# EAGLE design VGAX board rev 17 for JCL (EAGLE 9.6.2)
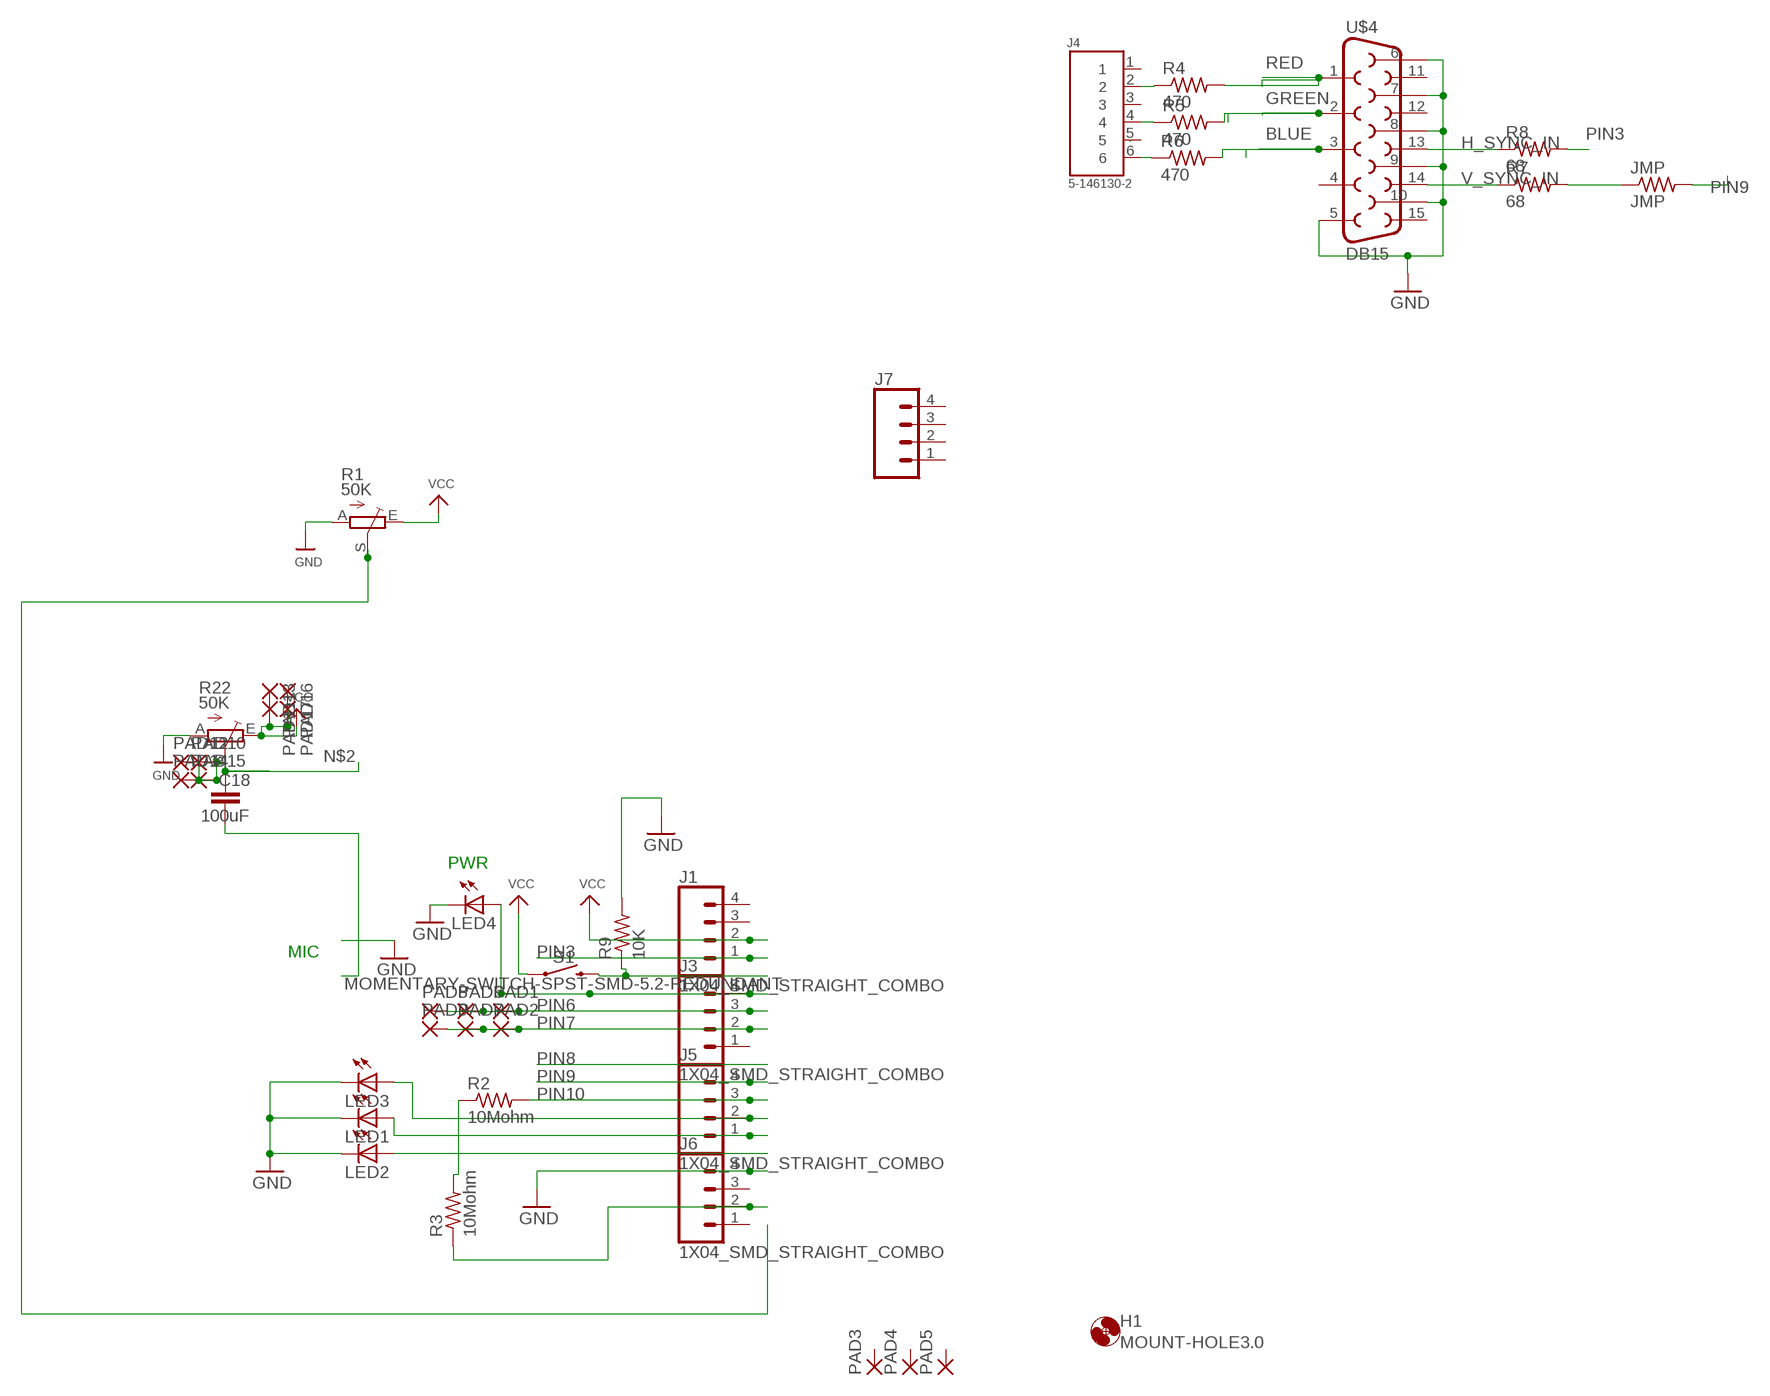
[diagram p0: schematic, sheet 1]

## Parts
C18  100uF  1.0UF-1206-50V-10%  [1206]
H1  MOUNT-HOLE3.0  [3,0]
J1  1X04_SMD_STRAIGHT_COMBO  CONN_04SMD_STRAIGHT_COMBO  [1X04_SMD_VERTICAL_COMBO]
J3  1X04_SMD_STRAIGHT_COMBO  CONN_04SMD_STRAIGHT_COMBO  [1X04_SMD_VERTICAL_COMBO]
J4  5-146130-2  [5-146130-2]
J5  1X04_SMD_STRAIGHT_COMBO  CONN_04SMD_STRAIGHT_COMBO  [1X04_SMD_VERTICAL_COMBO]
J6  1X04_SMD_STRAIGHT_COMBO  CONN_04SMD_STRAIGHT_COMBO  [1X04_SMD_VERTICAL_COMBO]
J7  1X04_SMD_STRAIGHT_COMBO  CONN_04SMD_STRAIGHT_COMBO  [1X04_SMD_VERTICAL_COMBO]
JMP  JMP  R-US_M1206  [M1206]
LED1  LEDCHIPLED_1206  [CHIPLED_1206]
LED2  LEDCHIPLED_1206  [CHIPLED_1206]
LED3  LEDCHIPLED_1206  [CHIPLED_1206]
LED4  LEDCHIPLED_1206  [CHIPLED_1206]
PAD1  SMD2  [SMD1,27-2,54]
PAD2  SMD2  [SMD1,27-2,54]
PAD3  SMD2  [SMD1,27-2,54]
PAD4  SMD2  [SMD1,27-2,54]
PAD5  SMD2  [SMD1,27-2,54]
PAD6  SMD2  [SMD1,27-2,54]
PAD7  SMD2  [SMD1,27-2,54]
PAD8  SMD2  [SMD1,27-2,54]
PAD9  SMD2  [SMD1,27-2,54]
PAD10  SMD2  [SMD1,27-2,54]
PAD11  SMD2  [SMD1,27-2,54]
PAD12  SMD2  [SMD1,27-2,54]
PAD13  SMD2  [SMD1,27-2,54]
PAD14  SMD2  [SMD1,27-2,54]
PAD15  SMD2  [SMD1,27-2,54]
PAD16  SMD2  [SMD1,27-2,54]
PAD17  SMD2  [SMD1,27-2,54]
R1  50K  TRIM_EU-CA9V  [CA9V]
R2  10Mohm  R-US_M1206  [M1206]
R3  10Mohm  R-US_M1206  [M1206]
R4  470  R-US_M1206  [M1206]
R5  470  R-US_M1206  [M1206]
R6  470  R-US_M1206  [M1206]
R7  68  R-US_M1206  [M1206]
R8  68  R-US_M1206  [M1206]
R9  10K  R-US_M1206  [M1206]
R22  50K  TRIM_EU-CA9V  [CA9V]
S1  MOMENTARY-SWITCH-SPST-SMD-5.2-REDUNDANT  [TACTILE_SWITCH_SMD_5.2MM]
U$4  DB15  [DB15]

## Nets
BLUE: R6.2 U$4.3
GND: J6.4 LED1.C LED2.C LED3.C LED4.C R1.A R9.2 R22.A U$4.5 U$4.6 U$4.7 U$4.8 U$4.9 U$4.10
GREEN: R5.2 U$4.2
H_SYNC_IN: R8.1 U$4.13
N$1: JMP.1 R7.2
N$2: C18.1 PAD10.1(P) PAD12.1(P) PAD14.1(P) PAD15.1(P) R22.S
N$4: R1.S
N$5: R2.1 R3.2
N$6: LED2.A
N$7: J5.1 LED1.A
N$8: J5.2 LED3.A
N$11: C18.2
N$12: J3.4 LED4.A
N$13: R9.1 S1.3 S1.4
N$15: J4.6 R6.1
N$16: J4.4 R5.1
N$17: J4.2 R4.1
PIN3: J1.1 R8.2
PIN6: J3.3 PAD1.1(P) PAD6.1(P) PAD8.1(P)
PIN7: J3.2 PAD2.1(P) PAD7.1(P) PAD9.1(P)
PIN8: J6.2 R3.1
PIN9: J5.4 JMP.2
PIN10: J5.3 R2.2
RED: R4.2 U$4.1
V_SYNC_IN: R7.1 U$4.14
VCC: J1.2 PAD11.1(P) PAD16.1(P) PAD17.1(P) R1.E R22.E S1.1 S1.2
Unconnected: J1.3 J1.4 J3.1 J4.1 J4.3 J4.5 J6.1 J6.3 J7.1 J7.2 J7.3 J7.4 PAD3.1(P) PAD4.1(P) PAD5.1(P) PAD13.1(P) U$4.4 U$4.11 U$4.12 U$4.15

## Notes on the sheet
- PWR
- MIC

## Library data of the parts
C18 = SparkFun-Capacitors:1.0UF: 1µF ceramic capacitors A capacitor is a passive two-terminal electrical component used to store electrical energy temporarily in an electric field.; PROD_ID: CAP-09822; VALUE: 1.0uF
H1 = holes:MOUNT-HOLE: MOUNTING HOLE with drill center marker
J1 J3 J5-J7 = SparkFun-Connectors:CONN_04: Multi connection point. Often used as Generic Header-pin footprint for 0.1 inch spaced/style header connections On any of the 0.1 inch spaced packages, you can populate with these: Break Away Headers - Straight <https://www.sparkfun.com/products/116> (PRT-00116) Break Away Male Headers - Right Angle <https://www.sparkfun.com/products/553> (PRT-00553) Female Headers <https://www.sparkfun.com/products/115> (PRT-00115) Break Away Headers - Machine Pin <https://www.sparkfun.com/products/117> (PRT-00117) Break Away Female Headers - Swiss Machine Pin <https://www.sparkfun.com/products/743> (PRT-00743) For SCREWTERMINALS and SPRING TERMINALS visit here: Screw Terimnals on SparkFun.com <https://www.sparkfun.com/search/results?term=Screw+Terminals> (5mm/3.5mm/2.54mm spacing) This device is also useful as a general connection point to wire up your design to another part of your project. Our various solder wires solder well into these plated through hole pads. Hook-Up Wire - Assortment (Stranded, 22 AWG) <https://www.sparkfun.com/products/11375> (PRT-11375) Hook-Up Wire - Assortment (Solid Core, 22 AWG) <https://www.sparkfun.com/products/11367> (PRT-11367) View the entire wire category on our website here <https://www.sparkfun.com/categories/141> Special notes: Molex polarized connector foot print use with SKU : PRT-08231 with associated crimp pins and housings. 1MM SMD Version SKU: PRT-10208; PROD_ID: CONN-08511
J4 = Connectors:5-146130-2: CONN HEADER SMD 6POS 2.54MM Manufacturer's datasheet <https://www.te.com/commerce/DocumentDelivery/DDEController?Action=srchrtrv&DocNm=146130&DocType=Customer+Drawing&DocLang=English>; CREATED_BY: PCBLayout.com; DIGIKEY_PART_NUMBER: 5-146130-2-ND; MANUFACTURER: TE Connectivity AMP Connectors; MPN: 5-146130-2
JMP R2-R9 = adafruit:R-US_: RESISTOR, American symbol
LED1-LED4 = adafruit:LED: LED OSRAM: - CHIPLED LG R971, LG N971, LY N971, LG Q971, LY Q971, LO R971, LY R971 LH N974, LH R974 LS Q976, LO Q976, LY Q976 LO Q996 - Hyper CHIPLED LW Q18S LB Q993, LB Q99A, LB R99A - SideLED LS A670, LO A670, LY A670, LG A670, LP A670 LB A673, LV A673, LT A673, LW A673 LH A674 LY A675 LS A676, LA A676, LO A676, LY A676, LW A676 LS A679, LY A679, LG A679 - Hyper Micro SIDELED® LS Y876, LA Y876, LO Y876, LY Y876 LT Y87S - SmartLED LW L88C, LW L88S LB L89C, LB L89S, LG L890 LS L89K, LO L89K, LY L89K LS L896, LA L896, LO L896, LY L896 - TOPLED LS T670, LO T670, LY T670, LG T670, LP T670 LSG T670, LSP T670, LSY T670, LOP T670, LYG T670 LG T671, LOG T671, LSG T671 LB T673, LV T673, LT T673, LW T673 LH T674 LS T676, LA T676, LO T676, LY T676, LB T676, LH T676, LSB T676, LW T676 LB T67C, LV T67C, LT T67C, LS T67K, LO T67K, LY T67K, LW E67C LS E67B, LA E67B, LO E67B, LY E67B, LB E67C, LV E67C, LT E67C LW T67C LS T679, LY T679, LG T679 LS T770, LO T770, LY T770, LG T770, LP T770 LB T773, LV T773, LT T773, LW T773 LH T774 LS E675, LA E675, LY E675, LS T675 LS T776, LA T776, LO T776, LY T776, LB T776 LHGB T686 LT T68C, LB T68C - Hyper Mini TOPLED® LB M676 - Mini TOPLED Santana® LG M470 LS M47K, LO M47K, LY M47K Source: http://www.osram.convergy.de/
PAD1-PAD17 = wirepad:SMD2: SMD PAD
R1 R22 = pot:TRIM_EU-: POTENTIOMETER
S1 = SparkFun-Switches:MOMENTARY-SWITCH-SPST: Momentary Switch (Pushbutton) - SPST Normally-open (NO) SPST momentary switches (buttons, pushbuttons). Variants PTH-12MM - 12mm square, through-hole Momentary Pushbutton Switch - 12mm Square <https://www.sparkfun.com/products/9190> (COM-09190) PTH-6.0MM, PTH-6.0MM-KIT - 6.0mm square, through-hole Mini Pushbutton Switch <https://www.sparkfun.com/products/97> (COM-00097) KIT package intended for soldering kit's - only one side of pads' copper is exposed. PTH-RIGHT-ANGLE-KIT - Right-angle, through-hole Right Angle Tactile Button <https://www.sparkfun.com/products/10791> - Used on SparkFun BigTime Watch Kit <https://www.sparkfun.com/products/11734> SMD-12MM - 12mm square, surface-mount Tactile Button - SMD (12mm) <https://www.sparkfun.com/products/12993> (COM-12993) Used on SparkFun PicoBoard <https://www.sparkfun.com/products/11888> SMD-4.5MM - 4.5mm Square Trackball Switch Used on SparkFun Blackberry Trackballer Breakout <https://www.sparkfun.com/products/13169> SMD-4.6MMX2.8MM - 4.60mm x 2.80mm, surface mount Used on SparkFun SAMD21 Mini Breakout <https://www.sparkfun.com/products/13664> SMD-5.2MM, SMD-5.2-REDUNDANT - 5.2mm square, surface-mount Mini Pushbutton Switch - SMD <https://www.sparkfun.com/products/8720> (COM-08720) Used on Arduino Pro Mini <https://www.sparkfun.com/products/11114> REDUNDANT package connects both switch circuits together SMD-6.0X3.5MM - 6.0 x 3.5mm, surface mount Momentary Reset Switch SMD <https://www.sparkfun.com/products/8229> (COM-08229) SMD-6.2MM-TALL - 6.2mm square, surface mount Tactile Button - SMD (6mm) <https://www.sparkfun.com/products/12992> Used on SparkFun Digital Sandbox <https://www.sparkfun.com/products/12651> SMD-RIGHT-ANGLE - Right-angle, surface mount Used on SparkFun Block for Intel® Edison - Arduino <https://www.sparkfun.com/products/13036>; PROD_ID: SWCH-08247; SF_SKU: COM-08720
U$4 = SparkFun-Retired:DB15: DB15 / VGA right angle through-hole female connector.

## Board
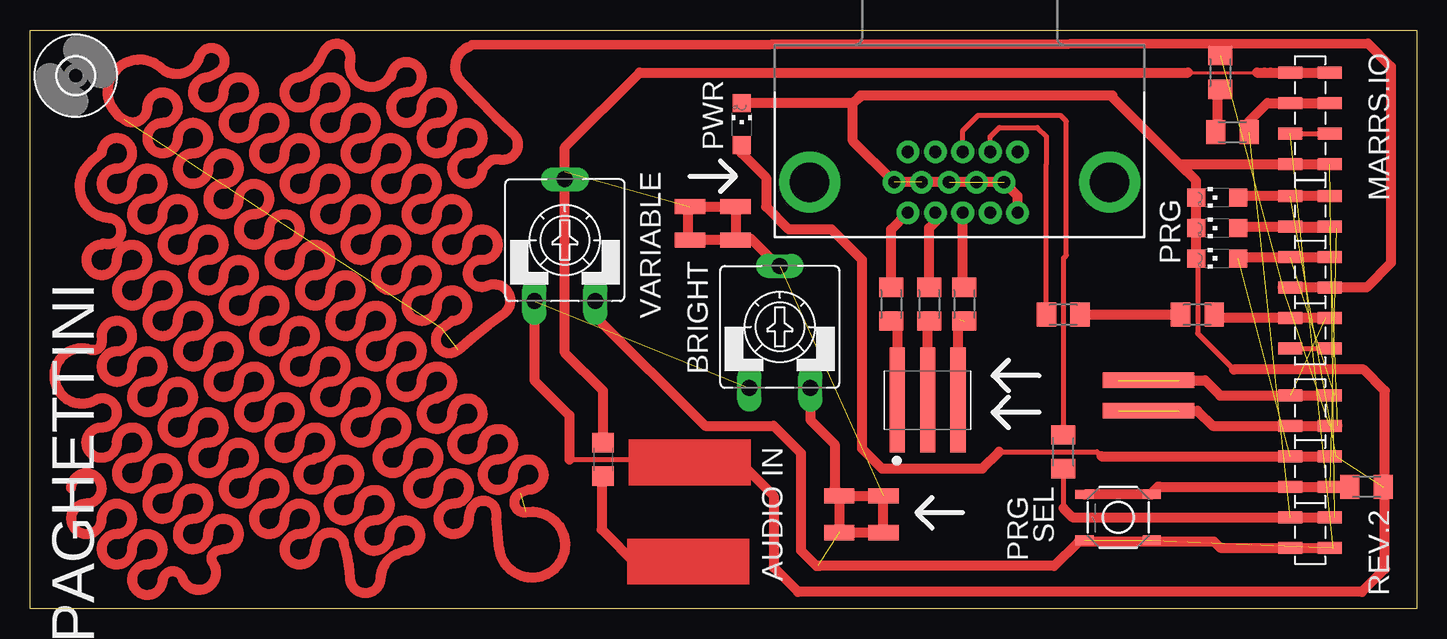
[diagram p1: board, top side]

Size 115.57 x 48.26 mm. Coordinates in mm from the lower left corner, seen from the top.
Outline: 115.57,48.26 115.57,0 0,0 0,48.26 115.57,48.26
Copper layers (1*16): Top 0.035mm / dielectric 0.2mm / Bottom 0.035mm
Design rules "JLC PCB DRU": minimum track width 3.5mil, minimum drill 0.2mm, track to track 3.5mil, track to pad 5mil, pad to pad 5mil, via to via 5mil, smd to smd 0mil, copper to edge 0.1mm, drill to drill 5mil, minimum pad ring 4mil, minimum via ring 4mil, stop-mask expansion 3mil, vias tented up to drill 100mil, thermal gap 10mil

### Footprints (pad centres in the part's own frame; a part is rotated, then mirrored left to right if it is on the bottom)
1206 = smd 1.6 x 1.8: 1 -1.4,0; 2 1.4,0
3,0 = hole 3: 0,0
1X04_SMD_VERTICAL_COMBO = smd 1 x 2: 1 0,-1.65; 1-2 0,1.65; 2 2.54,1.65; 2-2 2.54,-1.65; 3 5.08,-1.65; 3-2 5.08,1.65; 4 7.62,1.65; 4-2 7.62,-1.65
5-146130-2 = smd 1.27 x 3.56: 1 -2.54,-2.605; 2 -2.54,2.605; 3 0,-2.605; 4 0,2.605; 5 2.54,-2.605; 6 2.54,2.605
M1206 = smd 1.6 x 2: 1 -1.4,0; 2 1.4,0
CHIPLED_1206 = smd 1.5 x 1.5: A 0,-1.75; C 0,1.75
SMD1,27-2,54 = smd 1.27 x 2.54: 1 0,0
CA9V = drill 1.321 long: A -2.54,-5.08; E 2.54,-5.08; S 0,5.08
TACTILE_SWITCH_SMD_5.2MM = smd 1.524 x 0.762: 1 -2.794,1.905; 2 2.794,1.905; 3 -2.794,-1.905; 4 2.794,-1.905
DB15 = drill 1.016 pad 1.88: 1 -4.32,-7.62; 2 -2.03,-7.62; 3 0.26,-7.62; 4 2.55,-7.62; 5 4.84,-7.62; 6 -5.46,-5.08; 7 -3.17,-5.08; 8 -0.88,-5.08; 9 1.41,-5.08; 10 3.7,-5.08; 11 -4.32,-2.54; 12 -2.03,-2.54; 13 0.26,-2.54; 14 2.55,-2.54; 15 4.84,-2.54 | drill 3.302 pad 5.08: G1 -12.5,-5.08; G2 12.5,-5.08

### Placement (x,y rotation side)
C18  47.75,12.45 270 top
H1  3.81,44.45 0 top
J1  106.68,37.08 90 top
J3  106.68,26.8 90 top
J4  74.8,17.4 0 top
J5  106.68,10.16 90 top
J6  106.68,5.08 90 top
J7  106.68,21.72 90 top
JMP  97.28,24.51 0 top
LED1  98.93,31.75 90 top
LED2  98.93,34.29 90 top
LED3  98.93,29.21 90 top
LED4  59.31,40.39 0 top
PAD1  95.76,16.51 90 top
PAD2  95.76,19.05 90 top
PAD3  77.34,17.27 0 top
PAD4  74.8,17.27 0 top
PAD5  72.26,17.27 0 top
PAD6  90.68,16.51 90 top
PAD7  90.68,19.05 90 top
PAD8  93.22,16.51 90 top
PAD9  93.22,19.05 90 top
PAD10  58.8,30.73 270 top
PAD11  67.44,9.4 90 top
PAD12  71.12,9.4 90 top
PAD13  54.99,30.73 270 top
PAD14  58.8,33.53 90 top
PAD15  54.99,33.53 90 top
PAD16  67.44,6.35 90 top
PAD17  71.12,6.35 90 top
R1  44.58,30.73 0 top
R2  99.19,44.7 90 top
R3  100.2,39.75 180 top
R4  71.75,25.4 90 top
R5  74.93,25.4 90 top
R6  77.85,25.4 90 top
R7  86.11,24.51 0 top
R8  86.11,13.08 270 top
R9  111.38,10.16 0 top
R22  62.48,23.5 0 top
S1  90.68,7.62 180 top
U$4  77.47,40.64 0 top

### Tracks (layer width: path | path; a pad name or v marks a point on that pad's centre or on a via)
BLUE
  Top 0.813: R6.2 77.73,26.92 U$4.3
GND  (5 unrouted)
  Top 0.406: LED3.C 97.31,29.08 97.31,22.96 100.33,19.94 | 44.96,12.45 58.93,12.45
  Top 0.813: 69.09,42.67 69.22,42.8 90.2,42.8 90.2,42.67 95.79,37.08 | 69.09,42.67 68.58,42.16 68.58,42.14 | 69.09,42.67 69.22,42.67 | LED3.C LED1.C LED2.C 97.18,35.69 95.79,37.08 | 100.33,19.94 111.12,19.94 112.9,18.16 112.9,10.16 | 112.9,10.16 112.9,3.3 111,1.4 64.01,1.4 61.98,3.43 61.98,9.4 58.93,12.45 | U$4.5 82.31,34.42 U$4.10 U$4.6 68.58,38.99 68.58,42.14 | R1.A 42.04,19.05 44.96,16.13 44.96,12.45 | 68.58,42.14 LED4.C | R9.2 112.9,10.16 | J6.4 108.84,12.7 | 95.79,37.08 108.33,37.08
GREEN
  Top 0.813: R5.2 74.93,31.75 75.44,32.26 U$4.2
H_SYNC_IN
  Top 0.406: U$4.13 77.73,39.88 79,41.15 85.85,41.15 86.36,40.64 86.36,29.46 86.11,29.21 R8.1
N$1
  Top 0.813: R7.2 JMP.1
N$2  (2 unrouted)
  Top 0.813: R22.S 62.36,28.57 60.07,30.86 PAD10.1 | PAD10.1 PAD14.1 PAD15.1 54.86,33.4 54.86,30.73 PAD10.1 | C18.1 47.75,18.16 44.58,21.34 44.58,36.45
N$3
  Top 0.813: 37.72,36.7 38.23,37.21 arc-58 39.12,37.47 arc150 40.26,39.62 arc-5 35.93,43.95 arc-110 36.58,46.86
N$4
  Top 0.254: 96.52,44.7 102.23,44.7
  Top 0.813: R1.S 44.58,38.48 50.8,44.7 96.52,44.7 | 102.23,44.7 102.87,44.7 103.38,44.7 108.46,44.7
N$5
  Top 0.813: R2.1 98.93,43.05 98.93,39.88 R3.2
N$6
  Top 0.813: LED2.A 100.81,34.42 108.71,34.42
N$7  (1 unrouted)
  Top 0.813: LED1.A 100.81,31.88 108.71,31.88 108.84,31.75
N$8  (1 unrouted)
  Top 0.813: LED3.A 100.81,29.34 108.84,29.34
N$9
  Top 0.813: 11.05,40.51 arc270 12.32,39.24
N$10
  Top 0.813: 13.59,37.97 arc270 12.32,39.24
N$11
  Top 0.813: 47.73,11.02 C18.2 47.62,10.92 47.62,6.6 50.61,3.62 54.8,3.62 54.71,3.53
N$12  (1 unrouted)
  Top 0.406: 80.77,13.08 88.9,13.08 89.28,12.7
  Top 0.813: LED4.A 59.31,37.97 61.34,35.94 61.34,33.53 63.25,31.62 66.8,31.62 69.34,29.08 69.34,13.34 70.99,11.68 79.37,11.68 80.77,13.08 | 89.28,12.7 108.84,12.7
N$13
  Top 0.406: S1.3 93.34,9.52
  Top 0.813: 93.98,10.16 93.34,9.52 | S1.4 S1.3 94.11,10.16 R9.1
N$14
  Top 0.813: 14.86,36.7 arc-270 16.13,35.43
N$15  (1 unrouted)
  Top 0.813: J4.6 77.34,24 77.47,24.13
N$16
  Top 0.813: J4.4 74.8,23.87 R5.1
N$17
  Top 0.406: 72.26,23.49 J4.2
  Top 0.813: R4.1 72.26,23.49 72.26,18.92
N$18
  Top 0.813: 14.86,36.7 arc-270 13.59,37.97
N$19
  Top 0.813: 16.13,35.43 arc270 17.4,34.16
N$20
  Top 0.813: 17.4,34.16 arc-270 18.67,32.89
N$21
  Top 0.813: 18.67,32.89 arc270 19.94,31.62
N$22
  Top 0.813: 19.94,31.62 arc-270 21.21,30.35
N$23
  Top 0.813: 21.21,30.35 arc270 22.48,29.08
N$24
  Top 0.813: 22.48,29.08 arc-270 23.75,27.81
N$25
  Top 0.813: 23.75,27.81 arc270 25.02,26.54
N$26
  Top 0.813: 25.02,26.54 arc-270 26.29,25.27
N$27
  Top 0.813: 26.29,25.27 arc270 27.56,24
N$28
  Top 0.813: 27.56,24 arc-270 28.83,22.73
N$29
  Top 0.813: 28.83,22.73 arc270 30.1,21.46
N$30
  Top 0.813: 30.1,21.46 arc-270 31.37,20.19
N$31
  Top 0.813: 31.37,20.19 arc270 32.64,18.92
N$32
  Top 0.813: 32.64,18.92 arc-270 33.91,17.65
N$33
  Top 0.813: 35.18,16.26 arc-270 33.91,17.53
N$34
  Top 0.813: 33.91,17.53 34.67,17.91
N$35
  Top 0.813: 35.18,16.26 arc-270 36.45,14.99
N$36
  Top 0.813: 36.45,14.99 arc270 37.72,13.72
N$37
  Top 0.813: 37.72,13.72 arc-270 38.99,12.45
N$38
  Top 0.813: 38.99,12.45 arc270 40.26,11.18
N$39
  Top 0.813: 40.26,11.18 arc-270 41.53,9.91
N$40
  Top 0.813: 40.89,9.65 arc168 41.36,8.03
N$41
  Top 0.813: 9.78,3.68 arc270 11.05,2.41
N$42
  Top 0.813: 8.51,4.95 arc-270 9.78,3.68
N$43
  Top 0.813: 5.97,7.49 arc-270 7.24,6.22
N$44
  Top 0.813: 4.7,8.76 arc270 5.97,7.49
N$45
  Top 0.813: 3.43,10.03 arc-270 4.7,8.76
N$46
  Top 0.813: 7.24,6.22 arc270 8.51,4.95
N$47
  Top 0.813: 23.88,5.46 arc-152 26.16,5.46
N$48
  Top 0.813: 23.75,4.95 23.88,5.46
N$49
  Top 0.813: 22.48,6.22 arc270 23.75,4.95
N$50
  Top 0.813: 21.21,7.49 arc-270 22.48,6.22
N$51
  Top 0.813: 19.94,8.76 arc270 21.21,7.49
N$52
  Top 0.813: 18.67,10.03 arc-270 19.94,8.76
N$53
  Top 0.813: 17.4,11.3 arc270 18.67,10.03
N$54
  Top 0.813: 16.13,12.57 arc-270 17.4,11.3
N$55
  Top 0.813: 14.86,13.84 arc270 16.13,12.57
N$56
  Top 0.813: 13.59,15.11 arc-270 14.86,13.84
N$57
  Top 0.813: 12.32,16.38 arc270 13.59,15.11
N$58
  Top 0.813: 11.05,17.65 arc-270 12.32,16.38
N$59
  Top 0.813: 9.78,18.92 arc270 11.05,17.65
N$60
  Top 0.813: 7.24,21.46 arc270 5.97,22.73
N$61
  Top 0.813: 7.24,21.46 arc270 8.51,20.19
N$62
  Top 0.813: 8.51,20.19 arc-270 9.78,18.92
N$63
  Top 0.813: 13.59,22.73 arc270 14.86,21.46
N$64
  Top 0.813: 12.32,24 arc-270 13.59,22.73
N$65
  Top 0.813: 11.05,25.27 arc270 12.32,24
N$66
  Top 0.813: 5.97,30.35 arc270 7.24,29.08
N$67
  Top 0.813: 7.24,29.08 arc-270 8.51,27.81
N$68
  Top 0.813: 8.51,27.81 arc270 9.78,26.54
N$69
  Top 0.813: 9.78,26.54 arc-270 11.05,25.27
N$70
  Top 0.813: 14.86,21.46 arc-270 16.13,20.19
N$71
  Top 0.813: 16.13,20.19 arc270 17.4,18.92
N$72
  Top 0.813: 17.4,18.92 arc-270 18.67,17.65
N$73
  Top 0.813: 18.67,17.65 arc270 19.94,16.38
N$74
  Top 0.813: 19.94,16.38 arc-270 21.21,15.11
N$75
  Top 0.813: 21.21,15.11 arc270 22.48,13.84
N$76
  Top 0.813: 22.48,13.84 arc-270 23.75,12.57
N$77
  Top 0.813: 24.89,11.18 arc-270 23.62,12.45
N$78
  Top 0.813: 24.89,11.18 arc-270 26.16,9.91
N$79
  Top 0.813: 26.16,9.91 arc270 27.43,8.64
N$80
  Top 0.813: 27.43,8.64 arc-270 28.7,7.37
N$81
  Top 0.813: 28.7,7.37 arc270 29.97,6.1
N$82
  Top 0.813: 26.67,2.54 arc19 26.16,5.33
N$83
  Top 0.813: 29.21,2.54 arc-178 26.67,2.54
N$84
  Top 0.813: 30.61,4.57 arc67 29.21,2.54
N$85
  Top 0.813: 29.97,6.1 arc-270 31.24,4.83
N$86
  Top 0.813: 31.24,4.83 30.61,4.57
N$87
  Top 0.813: 9.78,41.78 arc-270 11.05,40.51
N$88
  Top 0.813: 7.87,40.77 arc124 9.78,41.78
N$89
  Top 0.813: 10.92,45.09 arc185 7.49,41.02
N$90
  Top 0.813: 14.1,45.97 arc-116 10.92,45.09
N$91
  Top 0.813: 15.62,44.7 arc227 14.1,45.97
N$92
  Top 0.813: 16.13,43.05 arc-270 14.86,44.32
N$93
  Top 0.813: 16.13,43.05 arc-270 17.4,41.78
N$94
  Top 0.813: 14.86,44.32 15.62,44.7
N$95
  Top 0.813: 17.4,41.78 arc270 18.67,40.51
N$96
  Top 0.813: 18.67,40.51 arc-270 19.94,39.24
N$97
  Top 0.813: 19.94,39.24 arc270 21.21,37.97
N$98
  Top 0.813: 21.21,37.97 arc-270 22.48,36.7
N$99
  Top 0.813: 22.48,36.7 arc270 23.75,35.43
N$100
  Top 0.813: 23.75,35.43 arc-270 25.02,34.16
N$101
  Top 0.813: 25.02,34.16 arc270 26.29,32.89
N$102
  Top 0.813: 26.29,32.89 arc-270 27.56,31.62
N$103
  Top 0.813: 27.56,31.62 arc270 28.83,30.35
N$104
  Top 0.813: 28.83,30.35 arc-270 30.1,29.08
N$105
  Top 0.813: 30.1,29.08 arc270 31.37,27.81
N$106
  Top 0.813: 31.37,27.81 arc-270 32.64,26.54
N$107
  Top 0.813: 32.64,26.54 arc270 33.91,25.27
N$108
  Top 0.813: 35.18,24 arc270 33.91,25.27
N$109
  Top 0.813: 34.31,23.35 arc188 35.69,21.59
N$110
  Top 0.813: 34.31,23.35 34.67,23.62
N$111
  Top 0.813: 34.67,23.62 35.18,24
N$112
  Top 0.813: 35.18,39.24 arc-270 36.45,37.97
N$113
  Top 0.813: 32.64,41.78 arc-270 33.91,40.51
N$114
  Top 0.813: 30.1,44.32 arc-270 31.37,43.05
N$115
  Top 0.813: 31.37,43.05 arc270 32.64,41.78
N$116
  Top 0.813: 33.91,40.51 arc270 35.18,39.24
N$117
  Top 0.813: 36.45,37.97 arc270 37.72,36.7
PIN2
  Top 0.813: 22.48,44.32 22.99,44.58
PIN3  (1 unrouted)
  Top 0.406: R8.2 86.11,8.38
  Top 0.813: 86.11,8.38 86.87,7.62 108.71,7.62
PIN4
  Top 0.813: 37.72,29.08 arc270 36.45,30.35 arc-270 35.18,31.62 arc270 33.91,32.89 arc-270 32.64,34.16 arc270 31.37,35.43 arc-270 30.1,36.7 arc270 28.83,37.97 arc-270 27.56,39.24 arc270 26.29,40.51 arc-270 25.02,41.78 arc270 23.75,43.05 arc-270 22.48,44.32 22.99,44.58 arc37 24.13,45.72 24.51,46.48 arc-166 26.67,45.72 arc168 30.1,44.58
PIN6  (3 unrouted)
  Top 0.813: PAD1.1 97.28,16.51 98.55,15.24 108.97,15.24 | J3.3 108.2,31.75 105.41,31.75
PIN7  (3 unrouted)
  Top 0.813: PAD2.1 97.92,19.05 99.19,17.78 108.71,17.78
PIN8  (1 unrouted)
  Top 0.813: R3.1 101.6,40.64 103.12,42.16 108.59,42.16 | J6.2 107.95,7.62
PIN9  (1 unrouted)
  Top 0.813: 98.81,24.38 JMP.2 98.94,24.26 107.95,24.26 108.84,24.26
PIN10  (2 unrouted)
  Top 0.813: 36.83,46.99 111.51,47.12 113.41,45.21 113.41,28.83 111.38,26.8 104.39,26.8
PIN12
  Top 0.813: 30.1,13.84 arc270 28.83,15.11 arc-270 27.56,16.38 arc270 26.29,17.65 arc-270 25.02,18.92 arc270 23.75,20.19 arc-270 22.48,21.46 arc270 21.21,22.73 arc-270 19.94,24 arc270 18.67,25.27 arc-270 17.4,26.54 arc270 16.13,27.81 arc-270 14.86,29.08 arc270 13.59,30.35 arc-270 12.32,31.62 arc270 11.05,32.89 arc-270 9.78,34.16 arc270 8.51,35.43 arc-270 7.24,36.7 arc270 5.97,37.97 5.08,37.23 arc136 6.58,32.59 arc-198 6.1,30.48
PIN14  (2 unrouted)
  Top 0.813: 37.85,29.08 arc216 38.1,26.92 arc-164 39.56,24.65 arc7 35.69,21.59 | 7.49,41.02 7.87,40.77 | 34.31,23.35
PIN18
  Top 0.813: 5.97,22.73 5.97,22.23 arc-109 5.08,21.59 arc221 5.21,17.27
PIN19
  Top 0.813: 5.46,17.4 arc-208 6.03,15.11 5.97,15.11 arc270 7.24,13.84 arc-270 8.51,12.57 arc270 9.78,11.3 arc-270 11.05,10.03 arc270 12.32,8.76 arc-270 13.59,7.49 arc270 14.86,6.22 arc-270 16.13,4.95 15.62,4.83 arc111 15.24,3.81 arc-197 12.7,2.54 arc161 11.05,2.29
PIN26
  Top 0.813: 30.99,14.22 30.23,13.84 arc270 31.5,12.57 arc-270 32.77,11.3 arc270 34.04,10.03 arc-270 35.31,8.76 arc270 36.58,7.49 36.7,8.13 arc-171 38.86,7.87
PIN27  (1 unrouted)
  Top 0.813: 41.53,9.91 40.89,9.65 | 41.36,8.03 arc-272 39.12,4.95 arc-5 38.86,7.62
RED
  Top 0.813: R4.2 71.75,31.62 U$4.1
V_SYNC_IN
  Top 0.406: U$4.14 80.02,39.37 80.78,40.13 83.95,40.13 84.71,39.37 84.71,37.08 84.71,37.09 R7.1
VCC  (4 unrouted)
  Top 0.813: R1.E 47.12,24.38 56.26,15.24 61.98,15.24 64.26,12.95 64.26,4.83 65.53,3.56 65.66,3.56 65.79,3.56 85.34,3.56 87.38,5.59 98.68,5.59 99.19,5.08 108.59,5.08 | R22.E 65.02,15.75 67.06,13.72 67.06,10.03 PAD11.1 | PAD11.1 70.23,9.4 | PAD11.1 PAD16.1 PAD17.1 71.12,8.89
(copper drawn outside any net)
  shapes: Top area x2

### Text on the board
tNames: MARRS.IO | PWR | VARIABLE | PRG | SPAGHETTINI | BRIGHT | PRG | REV.2 | SEL | AUDIO IN